# Altium project food_box_board.PrjPcb (part 1 of 2)
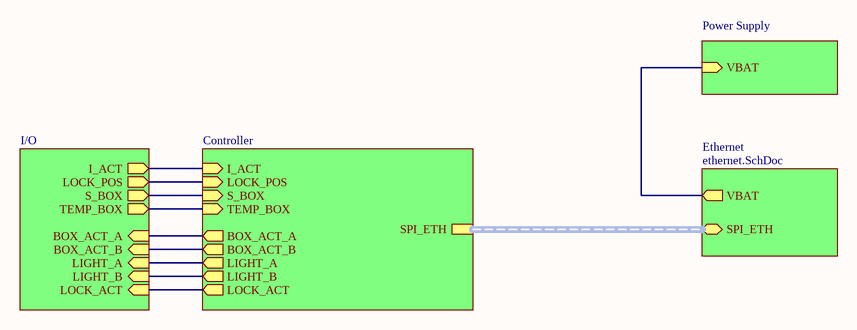
[diagram p0: food_box.SchDoc]
6 sheets, 76 parts. Net scope: hierarchical (ports join the sheet entries above them; power ports are global).
Board file: food_box_board.PcbDoc
Sheets:
  food_box.SchDoc
    Power Supply = power.SchDoc
    I/O = io.schdoc
      Light A = actuator.SchDoc
      Light B = actuator.SchDoc
      Box Actuator A = actuator.SchDoc
      Box Actuator B = actuator.SchDoc
    Controller = controller.SchDoc
    Ethernet = ethernet.SchDoc

## Sheet food_box.SchDoc
size Letter

### Sub-sheets
Controller = controller.SchDoc: LOCK_POS (in), S_BOX (in), TEMP_BOX (in), BOX_ACT_A (out), BOX_ACT_B (out), LIGHT_B (out), LIGHT_A (out), LOCK_ACT (out), I_ACT (in), SPI_ETH (harness SPI_ETH)
Ethernet = ethernet.SchDoc: SPI_ETH (bidir, harness SPI_ETH), VBAT (out)
I/O = io.schdoc: LOCK_POS (out), S_BOX (out), TEMP_BOX (out), BOX_ACT_A (in), LIGHT_B (in), LIGHT_A (in), BOX_ACT_B (in), LOCK_ACT (in), I_ACT (out)
Power Supply = power.SchDoc: VBAT (in)

### Nets
NetF1_1: sheet Power Supply/VBAT, sheet Ethernet/VBAT
NetH2_2: sheet I/O/LOCK_POS, sheet Controller/LOCK_POS
NetH5_1: sheet I/O/S_BOX, sheet Controller/S_BOX
NetR4_2: sheet I/O/LOCK_ACT, sheet Controller/LOCK_ACT
NetR11_Box_Actuator_A_2: sheet I/O/BOX_ACT_A, sheet Controller/BOX_ACT_A
NetR11_Box_Actuator_B_2: sheet I/O/BOX_ACT_B, sheet Controller/BOX_ACT_B
NetR11_Light_A_2: sheet I/O/LIGHT_A, sheet Controller/LIGHT_A
NetR11_Light_B_2: sheet I/O/LIGHT_B, sheet Controller/LIGHT_B
NetU_CN4_6: sheet I/O/TEMP_BOX, sheet Controller/TEMP_BOX
NetU_CN4_10: sheet I/O/I_ACT, sheet Controller/I_ACT

### Buses and harness runs
harness sheet Controller/SPI_ETH = sheet Ethernet/SPI_ETH

### Notes on the sheet
- Title
- Size:
- Date:
- Letter
- Number:
- Time:
- Revision:
- Sheet
- of
- File:

## Sheet power.SchDoc: Food Box Power Conditioning
size Letter
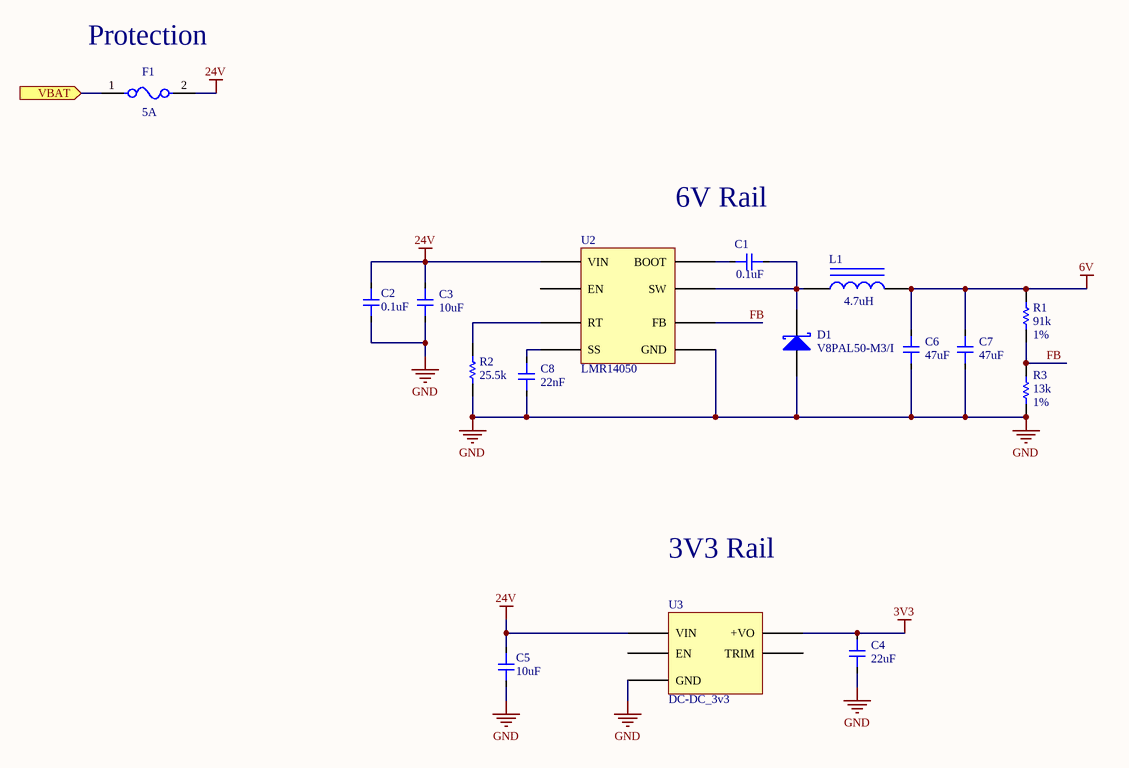
[diagram p1: power.SchDoc]

### Parts
C1  Capacitance: 0.1uF  [CAP 0805 L]  (hidden comment: value)
C2  Capacitance: 0.1uF  [CAP 0805 L]  (hidden comment: value)
C3  Capacitance: 10uF  [1210]  (hidden comment: value)
C4  Capacitance: 22uF  [CAP 0805 L]  (hidden comment: value)
C5  Capacitance: 10uF  [1206_CAP]  (hidden comment: value)
C6  Capacitance: 47uF  [1210]  (hidden comment: value)
C7  Capacitance: 47uF  [1210]  (hidden comment: value)
C8  value 22nF  [CAP 0805 L]  (hidden comment: value)
D1  Manufacturer Part Number: V8PAL50-M3/I  [DO-221BC]  (hidden comment: D Schottky)
F1  Current Rating: 5A  [Littelfuse_0154_0]  (hidden comment: 0154005.DRT)
L1  Inductance: 4.7uH  [SRP7050TA]  (hidden comment: Inductor Iron)
R1  Resistance: 91k  Tolerance: 1%  [RES 0603 L]  (hidden comment: Res1)
R2  Resistance: 25.5k  [RES 0603 L]  (hidden comment: Res1)
R3  Resistance: 13k  Tolerance: 1%  [RES 0603 L]  (hidden comment: Res1)
U2  LMR14050  [HSOIC-8]
U3  DC-DC_3v3  [V78E-1000-SMT]

### Ports
VBAT (in)

### Nets
3V3: C4.2 U3.4(+VO)
6V: C6.2 C7.2 L1.2 R1.2
24V: C2.2 C3.2 C5.2 F1.2 U2.2(VIN) U3.3(VIN)
GND: C2.1 C3.1 C4.1 C5.1 C6.1 C7.1 C8.1 D1.1(A) R2.1 R3.1 U2.7(GND) U3.2(GND)
FB: R1.1 R3.2 U2.5(FB)
NetC1_1: C1.1 U2.1(BOOT)
NetC1_2: C1.2 D1.2(K) L1.1 U2.8(SW)
NetC8_2: C8.2 U2.6(SS)
NetF1_1: F1.1 ; port VBAT
NetR2_2: R2.2 U2.4(RT)

Not connected (* = marked no-connect by the designer): U2 3(EN); U3 1(EN) 5(TRIM)

### Notes on the sheet
- (near F1) Protection
- 6V Rail
- 3V3 Rail
- Title
- Size:
- Date:
- Letter
- Number:
- Time:
- Revision:
- Sheet
- of
- File:

### Library data of the parts
C1 C2 = CAP 0805: CAP CER 0.1UF 50V X7R 0805; Manufacturer: Samsung; Manufacturer Part Number: CL21B104KBC5PNL; Tolerance: 10%; Supplier 1: Digi-Key; Supplier Part Number 1: 1276-7000-1-ND; Category: Ceramic Capacitors; Pricing 1: 1=0.10000, 10=0.06800, 50=0.03720, 100=0.03040, 500=0.02168, 1000=0.01704, 2500=0.01549, 5000=0.01425 (USD); Mount: Surface Mount; Case/Package: 0805; Min Operating Temperature: -55°C; Max Operating Temperature: 125°C; Voltage: 50V; Packaging: Tape and Reel; Dielectric: X7R; Length: 2mm; Height: 0.85mm; Depth: 1.25mm; Radiation Hardening: No; ComponentLink1URL: https://datasheet.ciiva.com/15195/getdatasheetpartid-359581-15195873.pdf?src-supplier=Verical; ComponentLink1Description: https://datasheet.ciiva.com/15195/getdatasheetpartid-359581-15195873.pdf?src-supplier=Verical
C3 = CAP 0805: TDK - C3225X7R1H106M250AC - C3225X7R1H106MT000E; Dielectric Material: Ceramic; Tolerance: 20%; Voltage Rating: 50V; Dielectric: X7R; Supplier 1: Digi-Key; Supplier Part Number 1: 445-14933-1-ND; Manufacturer: TDK; Manufacturer Part Number: C3225X7R1H106M250AC; Category: Ceramic Capacitors; Pricing 1: 1=1.03000, 10=0.78700, 50=0.65340, 100=0.56270, 500=0.43560 (USD); Mount: Surface Mount; Case/Package: 1210; Weight: 0.000564oz; Case Code (Metric): 3225; Case Code (Imperial): 1210; Min Operating Temperature: -55°C; Max Operating Temperature: 125°C; Package Quantity: 1000; Packaging: Tape and Reel; Termination: SMD/SMT; Voltage Rating (DC): 50V; Length: 0.126inch; Height: 2.5mm; Thickness: 0.11inch; Width: 0.098inch; REACH SVHC: No SVHC; Lead Free: Lead Free; ComponentLink1URL: http://www.farnell.com/datasheets/2792994.pdf?src-supplier=Farnell; ComponentLink1Description: http://www.farnell.com/datasheets/2792994.pdf?src-supplier=Farnell; ComponentLink2URL: http://www.mouser.com/ds/2/400/tdk_mlcc_commercial_general_en-542463.pdf?src-supplier=Mouser; ComponentLink2Description: http://www.mouser.com/ds/2/400/tdk_mlcc_commercial_general_en-542463.pdf?src-supplier=Mouser; ComponentLink3URL: https://product.tdk.com/info/en/documents/chara_sheet/C3225X7R1H106M250AC.pdf?src-supplier=Digi-Key; ComponentLink3Description: https://product.tdk.com/info/en/documents/chara_sheet/C3225X7R1H106M250AC.pdf?src-supplier=Digi-Key; ComponentLink4URL: http://product.tdk.com/capacitor/mlcc/en/documents/mlcc_commercial_general_en.pdf?src-supplier=Avnet; ComponentLink4Description: http://product.tdk.com/capacitor/mlcc/en/documents/mlcc_commercial_general_en.pdf?src-supplier=Avnet; ComponentLink5URL: http://www.farnell.com/datasheets/1913358.pdf?src-supplier=Element14; ComponentLink5Description: http://www.farnell.com/datasheets/1913358.pdf?src-supplier=Element14; ComponentLink6URL: http://www.farnell.com/datasheets/2291921.pdf?src-supplier=Newark; ComponentLink6Description: http://www.farnell.com/datasheets/2291921.pdf?src-supplier=Newark
C4 = CAP 0805: CAP CER 22UF 10V X6S 0805; Manufacturer: Murata; Manufacturer Part Number: GRT21BC81A226ME13L; Tolerance: 20%; Supplier 1: Digi-Key; Supplier Part Number 1: 490-12342-1-ND; Category: Ceramic Capacitors; Pricing 1: 1=0.61000, 10=0.42900, 50=0.32460, 100=0.28260, 500=0.20938, 1000=0.17796 (USD); Mount: Surface Mount; Case/Package: 0805; Case Code (Metric): 2012; Case Code (Imperial): 0805; Min Operating Temperature: -55°C; Max Operating Temperature: 105°C; Packaging: Tape and Reel; Voltage Rating: 10V; Length: 0.079inch; Width: 0.049inch; Thickness: 0.057inch; Ratings: AEC-Q200; Lead Free: Lead Free; ComponentLink1URL: http://search.murata.co.jp/Ceramy/image/img/A01X/G101/ENG/GRT21BC81A226ME13-01.pdf?src-supplier=Digi-Key; ComponentLink1Description: http://search.murata.co.jp/Ceramy/image/img/A01X/G101/ENG/GRT21BC81A226ME13-01.pdf?src-supplier=Digi-Key
C5 = CAP 0805: MURATA - GRT31CR61H106KE01L - SMD Multilayer Ceramic Capacitor, 10 µF, 50 V, 1206 [3216 Metric], ± 10%, X5R, GRT Series; Voltage Rating: 50V; Supplier 1: Digi-Key; Supplier Part Number 1: 490-12456-1-ND; Manufacturer: Murata; Manufacturer Part Number: GRT31CR61H106KE01L; Category: Ceramic Capacitors; Pricing 1: 1=0.73000, 10=0.51400, 50=0.38840, 100=0.33840, 500=0.25064, 1000=0.21304 (USD); Mount: Surface Mount; Case/Package: 1206; Case Code (Metric): 3216; Case Code (Imperial): 1206; Min Operating Temperature: -55°C; Max Operating Temperature: 85°C; Packaging: Cut Tape; Tolerance: 10%; Dielectric: X5R; Voltage Rating (DC): 50V; Length: 0.126inch; Width: 0.063inch; Thickness: 0.071inch; Ratings: AEC-Q200; ComponentLink1URL: http://www.farnell.com/datasheets/2166010.pdf?src-supplier=Farnell; ComponentLink1Description: http://www.farnell.com/datasheets/2166010.pdf?src-supplier=Farnell; ComponentLink2URL: http://search.murata.co.jp/Ceramy/image/img/A01X/G101/ENG/GRT31CR61H106KE01-01.pdf?src-supplier=Digi-Key; ComponentLink2Description: http://search.murata.co.jp/Ceramy/image/img/A01X/G101/ENG/GRT31CR61H106KE01-01.pdf?src-supplier=Digi-Key; ComponentLink3URL: http://www.farnell.com/datasheets/2166010.pdf?src-supplier=Newark; ComponentLink3Description: http://www.farnell.com/datasheets/2166010.pdf?src-supplier=Newark; ComponentLink4URL: http://www.farnell.com/datasheets/2166010.pdf?src-supplier=Element14; ComponentLink4Description: http://www.farnell.com/datasheets/2166010.pdf?src-supplier=Element14
C6 C7 = CAP 0805: KEMET - C1210C476M4PACTU. - CAPACITOR CERAMIC 47UF, 16V, X5R, 1210; Tolerance: 20%; Dissipation Factor: 10%; Supplier 1: Digi-Key; Supplier Part Number 1: 399-5514-1-ND; Manufacturer: KEMET; Manufacturer Part Number: C1210C476M4PACTU; Category: Ceramic Capacitors; Pricing 1: 1=1.16000, 10=0.88500, 50=0.73500, 100=0.63300, 500=0.49006 (USD); Mount: Surface Mount,PCB; Case/Package: 1210; Number of Pins: 2; Case Code (Metric): 3225; Case Code (Imperial): 1210; Dielectric Material: Ceramic; Contact Plating: Tin,Matte; Min Operating Temperature: -55°C; Max Operating Temperature: 85°C; Package Quantity: 1; Voltage Rating: 16V; Packaging: Tape and Reel; Voltage Rating (DC): 16V; Dielectric: X5R; Termination: SMD/SMT; Voltage: 16V; Length: 3.2mm; Height: 2.5mm; Width: 0.098inch; Depth: 2.5mm; Thickness: 0.11inch; Radiation Hardening: No; Lead Free: Lead Free; REACH SVHC: No SVHC; ComponentLink1URL: https://datasheet.ciiva.com/22705/652158-22705488.pdf?src-supplier=Element14; ComponentLink1Description: https://datasheet.ciiva.com/22705/652158-22705488.pdf?src-supplier=Element14; ComponentLink2URL: https://datasheet.ciiva.com/28608/1918694-28608774.pdf?src-supplier=Element14; ComponentLink2Description: https://datasheet.ciiva.com/28608/1918694-28608774.pdf?src-supplier=Element14
C8 = CAP 0805: Manufacturer: Yageo; Manufacturer Part Number: AC0805KRX7R8BB223; Voltage: 25V; Supplier 1: Digi-Key; Supplier Part Number 1: 311-3170-1-ND; Stock 1: 1274; Pricing 1: 1=0.24000, 10=0.16300, 100=0.08260, 500=0.05654, 1000=0.05001 (USD); RoHS: No
D1 = D Schottky: Schottky Diode; Manufacturer: Vishay Semiconductors; Forward Voltage: 570mV; Max Reverse Voltage (DC): 50V; Element Configuration: Single; Average Rectified Current: 4A; Forward Current: 8A; Max Forward Surge Current (Ifsm): 120A; Peak Reverse Current: 40mA; PackageDescription: DO-214-AA/SMB; 2 C-Bend Leads; Body 5.3 x 3.6 mm, inc. leads (LxW); Code_JEDEC: DO-214-AA; Supplier 1: Digi-Key; Supplier Part Number 1: V8PAL50-M3/ICT-ND; Stock 1: 9149; Pricing 1: 1=0.87000, 10=0.76600, 25=0.72000, 100=0.52250, 250=0.50388, 500=0.43654, 1000=0.37152, 2500=0.34830, 5000=0.31347 (USD); RoHS: Yes; Mount: Surface Mount; Number of Pins: 2; Weight: 0.001129oz; Min Operating Temperature: -40°C; Max Operating Temperature: 150°C; Packaging: Tape and Reel; Package Quantity: 14000; Max Repetitive Reverse Voltage (Vrrm): 50V; Peak Non-Repetitive Surge Current: 120A; Length: 4.35mm; Height: 1mm; Width: 2.7mm; REACH SVHC: Unknown; ComponentLink1URL: https://datasheet.ciiva.com/29591/v8pal50-29591381.pdf?src-supplier=Digi-Key; ComponentLink1Description: https://datasheet.ciiva.com/29591/v8pal50-29591381.pdf?src-supplier=Digi-Key; ComponentLink2URL: https://datasheet.ciiva.com/29591/v8pal50-29591382.pdf?src-supplier=Digi-Key; ComponentLink2Description: https://datasheet.ciiva.com/29591/v8pal50-29591382.pdf?src-supplier=Digi-Key; ComponentLink3URL: https://datasheet.ciiva.com/29591/v8pal50-29591383.pdf?src-supplier=Digi-Key; ComponentLink3Description: https://datasheet.ciiva.com/29591/v8pal50-29591383.pdf?src-supplier=Digi-Key
F1 = 0154005.DRT: FUSE BRD MNT 5A 125VAC/VDC 2SMD; Manufacturer: Littelfuse; Manufacturer Part Number: 0154005DRT; Color: White; Body Material: Ceramic,Thermoplastic; Voltage Rating (AC): 125V; DC Cold Resistance: 13.6mR; Power Dissipation: 125W; Fuse Type: Board Mount (Cartridge Style Excluded); Approvals: UL,PSE; Supplier 1: Digi-Key; Supplier Part Number 1: F1310CT-ND; Category: Fuses; Pricing 1: 1=3.140000, 5=3.040000, 10=2.935000, 50=2.306200, 100=1.886900, 250=1.834520, 500=1.572460 (USD); Mount: Surface Mount,Holder; Case/Package: SMD/SMT; Number of Pins: 2; Terminal Material: Copper; Min Operating Temperature: -55°C; Max Operating Temperature: 125°C; Packaging: Tape and Reel; Voltage Rating (DC): 125V; Package Quantity: 1500; Working Voltage: 125V; Voltage Rating: 125V; Termination: SMD/SMT; Fuse Current: 5A; Length: 9.73mm; Height: 3.81mm; Width: 5.03mm; Depth: 5.03mm; Radiation Hardening: No; Lead Free: Lead Free; REACH SVHC: Unknown; Flammability Rating: UL94 V-0; ComponentLink1URL: https://datasheet.ciiva.com/15187/getdatasheetpartid-71302-15187877.pdf?src-supplier=Verical; ComponentLink1Description: https://datasheet.ciiva.com/15187/getdatasheetpartid-71302-15187877.pdf?src-supplier=Verical; ComponentLink2URL: https://datasheet.ciiva.com/14159/aa154xxx-data-e-14159686.pdf?src-supplier=Distrelec; ComponentLink2Description: https://datasheet.ciiva.com/14159/aa154xxx-data-e-14159686.pdf?src-supplier=Distrelec; ComponentLink3URL: https://datasheet.ciiva.com/22712/1840330-22712966.pdf?src-supplier=Element14; ComponentLink3Description: https://datasheet.ciiva.com/22712/1840330-22712966.pdf?src-supplier=Element14; ComponentLink4URL: https://datasheet.ciiva.com/1268/1840330-1268664.pdf?src-supplier=Element14; ComponentLink4Description: https://datasheet.ciiva.com/1268/1840330-1268664.pdf?src-supplier=Element14; ComponentLink5URL: https://datasheet.ciiva.com/4483/littelfuse-fuse-154-154t-154l-154tl-datasheet-pdf-309941-4483517.pdf?src-supplier=Mouser; ComponentLink5Description: https://datasheet.ciiva.com/4483/littelfuse-fuse-154-154t-154l-154tl-datasheet-pdf-309941-4483517.pdf?src-supplier=Mouser; ComponentLink6URL: https://datasheet.ciiva.com/46406/1840330-46406109.pdf?src-supplier=Element14; ComponentLink6Description: https://datasheet.ciiva.com/46406/1840330-46406109.pdf?src-supplier=Element14; ComponentLink7URL: https://datasheet.ciiva.com/46406/1788337-46406175.pdf?src-supplier=Element14; ComponentLink7Description: https://datasheet.ciiva.com/46406/1788337-46406175.pdf?src-supplier=Element14
L1 = Inductor Iron: FIXED IND 4.7UH 6.5A 30.8 MOHM; Manufacturer: Bourns; Manufacturer Part Number: SRP7050TA-4R7M; Core Material: Carbonyl Powder; Saturation Current: 10A; Shielding: Shielded; DC Resistance (DCR): 30.8mR; Self Resonant Frequency: 22MHz; Test Frequency: 100kHz; Tolerance: 20%; Supplier 1: Digi-Key; Supplier Part Number 1: SRP7050TA-4R7MCT-ND; Category: Fixed Inductors; Pricing 1: 1=1.42000, 10=1.32300, 25=1.22120, 50=1.01760, 100=0.95650, 250=0.85472 (USD); Mount: Surface Mount; Case/Package: Nonstandard; Min Operating Temperature: -40°C; Max Operating Temperature: 150°C; Packaging: Cut Tape; Composition: Wirewound; Current Rating: 6.5A; RMS Current (Irms): 6.5A; Inductance Tolerance: 20%; Length: 0.287inch; Width: 0.26inch; Height - Seated (Max): 0.197inch; Ratings: AEC-Q200; REACH SVHC: No SVHC; ComponentLink1URL: http://www.bourns.com/docs/Product-Datasheets/SRP7050TA.pdf?src-supplier=Digi-Key; ComponentLink1Description: http://www.bourns.com/docs/Product-Datasheets/SRP7050TA.pdf?src-supplier=Digi-Key; ComponentLink2URL: http://www.farnell.com/datasheets/1955472.pdf?src-supplier=Element14; ComponentLink2Description: http://www.farnell.com/datasheets/1955472.pdf?src-supplier=Element14; ComponentLink3URL: https://www.bourns.com/docs/Product-Datasheets/SRP7050TA.pdf?src-supplier=Digi-Key; ComponentLink3Description: https://www.bourns.com/docs/Product-Datasheets/SRP7050TA.pdf?src-supplier=Digi-Key
R1 = Res1: Res Thick Film 0603 91K Ohm 1% 1/10W ±100ppm/°C Molded SMD SMD Paper T/R; Manufacturer: Vishay; Manufacturer Part Number: CRCW060391K0FKEA; Power Rating: 100mW; Voltage Rating: 75V; Supplier 1: Digi-Key; Supplier Part Number 1: 541-91.0KHCT-ND; Category: Chip SMD Resistors; Pricing 1: 1=0.10000, 10=0.03400, 100=0.01390, 1000=0.00623, 2500=0.00540 (USD); Mount: Surface Mount; Case/Package: 0603; Number of Pins: 2; Weight: 7.1E-05oz; Contact Plating: Tin; Case Code (Metric): 1608; Case Code (Imperial): 0603; Min Operating Temperature: -55°C; Max Operating Temperature: 155°C; Composition: Thick Film; Temperature Coefficient: 100ppm/°C; Packaging: Tape and Reel; Package Quantity: 10; Number of Terminations: 2; Termination: SMD/SMT; Max Power Dissipation: 100mW; Features: Automotive AEC-Q200; Military Standard: Not; Voltage Rating (DC): 75V; Length: 1.55mm; Height: 0.45mm; Width: 0.033inch; Depth: 0.85mm; Radiation Hardening: No; Lead Free: Lead Free; REACH SVHC: Unknown; ComponentLink1URL: https://datasheet.ciiva.com/11810/0900766b80d98afc-11810338.pdf?src-supplier=RSComponents; ComponentLink1Description: https://datasheet.ciiva.com/11810/0900766b80d98afc-11810338.pdf?src-supplier=RSComponents; ComponentLink2URL: https://datasheet.ciiva.com/2513/dcrcwe3-2513648.pdf?src-supplier=Digi-Key; ComponentLink2Description: https://datasheet.ciiva.com/2513/dcrcwe3-2513648.pdf?src-supplier=Digi-Key; ComponentLink3URL: https://datasheet.ciiva.com/2513/dcrcwe3-2513649.pdf?src-supplier=Digi-Key; ComponentLink3Description: https://datasheet.ciiva.com/2513/dcrcwe3-2513649.pdf?src-supplier=Digi-Key; ComponentLink4URL: https://datasheet.ciiva.com/7816/1697337-7816085.pdf?src-supplier=Element14; ComponentLink4Description: https://datasheet.ciiva.com/7816/1697337-7816085.pdf?src-supplier=Element14; ComponentLink5URL: https://datasheet.ciiva.com/16397/dcrcwe3-16397320.pdf?src-supplier=Future+Electronics; ComponentLink5Description: https://datasheet.ciiva.com/16397/dcrcwe3-16397320.pdf?src-supplier=Future+Electronics; ComponentLink6URL: https://datasheet.ciiva.com/16771/70201119-16771080.pdf?src-supplier=Allied+Electronics; ComponentLink6Description: https://datasheet.ciiva.com/16771/70201119-16771080.pdf?src-supplier=Allied+Electronics; ComponentLink7URL: https://datasheet.ciiva.com/26317/fld-crcw-e3-data-en-26317164.pdf?src-supplier=Distrelec; ComponentLink7Description: https://datasheet.ciiva.com/26317/fld-crcw-e3-data-en-26317164.pdf?src-supplier=Distrelec; ComponentLink8URL: https://datasheet.ciiva.com/8984/dcrcwe3-8984413.pdf?src-supplier=Avnet; ComponentLink8Description: https://datasheet.ciiva.com/8984/dcrcwe3-8984413.pdf?src-supplier=Avnet; ComponentLink9URL: https://datasheet.ciiva.com/5547/dcrcwe3-109170-5547038.pdf?src-supplier=Mouser; ComponentLink9Description: https://datasheet.ciiva.com/5547/dcrcwe3-109170-5547038.pdf?src-supplier=Mouser; ComponentLink10URL: https://datasheet.ciiva.com/2513/dcrcwe3-2513647.pdf?src-supplier=Digi-Key; ComponentLink10Description: https://datasheet.ciiva.com/2513/dcrcwe3-2513647.pdf?src-supplier=Digi-Key
R2 = Res1: RES SMD 25.5K OHM 1% 1/10W 0603; Manufacturer: Vishay; Manufacturer Part Number: CRCW060325K5FKEA; Temperature Coefficient: 100ppm/°C; Power Rating: 100mW; Voltage Rating: 75V; Supplier 1: Digi-Key; Supplier Part Number 1: 541-25.5KHCT-ND; Category: Chip SMD Resistors; Pricing 1: 1=0.10000, 10=0.03400, 100=0.01390, 1000=0.00623, 2500=0.00540 (USD); Case/Package: 0603; Number of Pins: 2; Weight: 7.1E-05oz; Contact Plating: Tin; Case Code (Metric): 1608; Case Code (Imperial): 0603; Min Operating Temperature: -55°C; Max Operating Temperature: 155°C; Tolerance: 1%; Packaging: Tape and Reel; Composition: Thick Film; Package Quantity: 10; Number of Terminations: 2; Termination: SMD/SMT; Max Power Dissipation: 100mW; Features: Automotive AEC-Q200; Military Standard: Not; Voltage Rating (DC): 75V; Working Voltage: 75V; Length: 1.55mm; Height: 0.45mm; Width: 0.033inch; Depth: 0.85mm; Radiation Hardening: No; Lead Free: Lead Free; REACH SVHC: Unknown; ComponentLink1URL: https://datasheet.ciiva.com/11810/0900766b80d98afc-11810483.pdf?src-supplier=RSComponents; ComponentLink1Description: https://datasheet.ciiva.com/11810/0900766b80d98afc-11810483.pdf?src-supplier=RSComponents; ComponentLink2URL: https://datasheet.ciiva.com/2465/dcrcwe3-2465664.pdf?src-supplier=Digi-Key; ComponentLink2Description: https://datasheet.ciiva.com/2465/dcrcwe3-2465664.pdf?src-supplier=Digi-Key; ComponentLink3URL: https://datasheet.ciiva.com/2465/dcrcwe3-2465665.pdf?src-supplier=Digi-Key; ComponentLink3Description: https://datasheet.ciiva.com/2465/dcrcwe3-2465665.pdf?src-supplier=Digi-Key; ComponentLink4URL: https://datasheet.ciiva.com/3257/dcrcwe3-3257318.pdf?src-supplier=Avnet; ComponentLink4Description: https://datasheet.ciiva.com/3257/dcrcwe3-3257318.pdf?src-supplier=Avnet; ComponentLink5URL: https://datasheet.ciiva.com/3257/dcrcwe3-3257319.pdf?src-supplier=Avnet; ComponentLink5Description: https://datasheet.ciiva.com/3257/dcrcwe3-3257319.pdf?src-supplier=Avnet; ComponentLink6URL: https://datasheet.ciiva.com/16202/dcrcwe3-16202503.pdf?src-supplier=Future+Electronics; ComponentLink6Description: https://datasheet.ciiva.com/16202/dcrcwe3-16202503.pdf?src-supplier=Future+Electronics; ComponentLink7URL: https://datasheet.ciiva.com/7173/1635184-7173016.pdf?src-supplier=Newark; ComponentLink7Description: https://datasheet.ciiva.com/7173/1635184-7173016.pdf?src-supplier=Newark; ComponentLink8URL: https://datasheet.ciiva.com/16882/dcrcwe3-16882729.pdf?src-supplier=Avnet+Europe; ComponentLink8Description: https://datasheet.ciiva.com/16882/dcrcwe3-16882729.pdf?src-supplier=Avnet+Europe; ComponentLink9URL: https://datasheet.ciiva.com/22675/1847332-22675962.pdf?src-supplier=Element14; ComponentLink9Description: https://datasheet.ciiva.com/22675/1847332-22675962.pdf?src-supplier=Element14; ComponentLink10URL: https://datasheet.ciiva.com/22702/1697337-22702891.pdf?src-supplier=Element14; ComponentLink10Description: https://datasheet.ciiva.com/22702/1697337-22702891.pdf?src-supplier=Element14; ComponentLink11URL: https://datasheet.ciiva.com/22869/70201119-22869452.pdf?src-supplier=Allied+Electronics; ComponentLink11Description: https://datasheet.ciiva.com/22869/70201119-22869452.pdf?src-supplier=Allied+Electronics; ComponentLink12URL: https://datasheet.ciiva.com/2465/dcrcwe3-2465663.pdf?src-supplier=Digi-Key; ComponentLink12Description: https://datasheet.ciiva.com/2465/dcrcwe3-2465663.pdf?src-supplier=Digi-Key; ComponentLink13URL: https://datasheet.ciiva.com/5541/dcrcwe3-109170-5541965.pdf?src-supplier=Mouser; ComponentLink13Description: https://datasheet.ciiva.com/5541/dcrcwe3-109170-5541965.pdf?src-supplier=Mouser
R3 = Res1: Res Thick Film 0603 13K Ohm 1% 1/10W 100ppm/C Molded SMD SMD Paper T/R; Manufacturer: Vishay Dale; Manufacturer Part Number: CRCW060313K0FKTA; Power Rating: 100mW; Voltage Rating: 75V; Temperature Coefficient: 100ppm/°C; Supplier 1: Digi-Key; Supplier Part Number 1: 541-CRCW060313K0FKTACT-ND; Category: Chip SMD Resistors; Pricing 1: 1=0.13000, 10=0.12000, 100=0.04620, 1000=0.02033, 2500=0.01756 (USD); Case/Package: 0603; Number of Pins: 2; Weight: 7.1E-05oz; Case Code (Imperial): 0603; Case Code (Metric): 1608; Contact Plating: Tin,Lead; Min Operating Temperature: -55°C; Max Operating Temperature: 155°C; Packaging: Tape and Reel; Package Quantity: 5000; Composition: Thick Film; Number of Terminations: 2; Military Standard: Not; Max Power Dissipation: 100mW; Power Dissipation: 100mW; Voltage Rating (DC): 75V; Features: Automotive AEC-Q200; Length: 1.55mm; Height: 0.02inch; Width: 0.85mm; Depth: 0.85mm; Radiation Hardening: No; Lead Free: Contains Lead; REACH SVHC: Unknown; ComponentLink1URL: https://datasheet.ciiva.com/15159/getdatasheetpartid-33120-15159398.pdf?src-supplier=Verical; ComponentLink1Description: https://datasheet.ciiva.com/15159/getdatasheetpartid-33120-15159398.pdf?src-supplier=Verical; ComponentLink2URL: https://datasheet.ciiva.com/2564/dcrcw-2564949.pdf?src-supplier=Digi-Key; ComponentLink2Description: https://datasheet.ciiva.com/2564/dcrcw-2564949.pdf?src-supplier=Digi-Key; ComponentLink3URL: https://datasheet.ciiva.com/9043/dcrcw-9043261.pdf?src-supplier=Avnet; ComponentLink3Description: https://datasheet.ciiva.com/9043/dcrcw-9043261.pdf?src-supplier=Avnet

## Sheet io.schdoc
size Letter
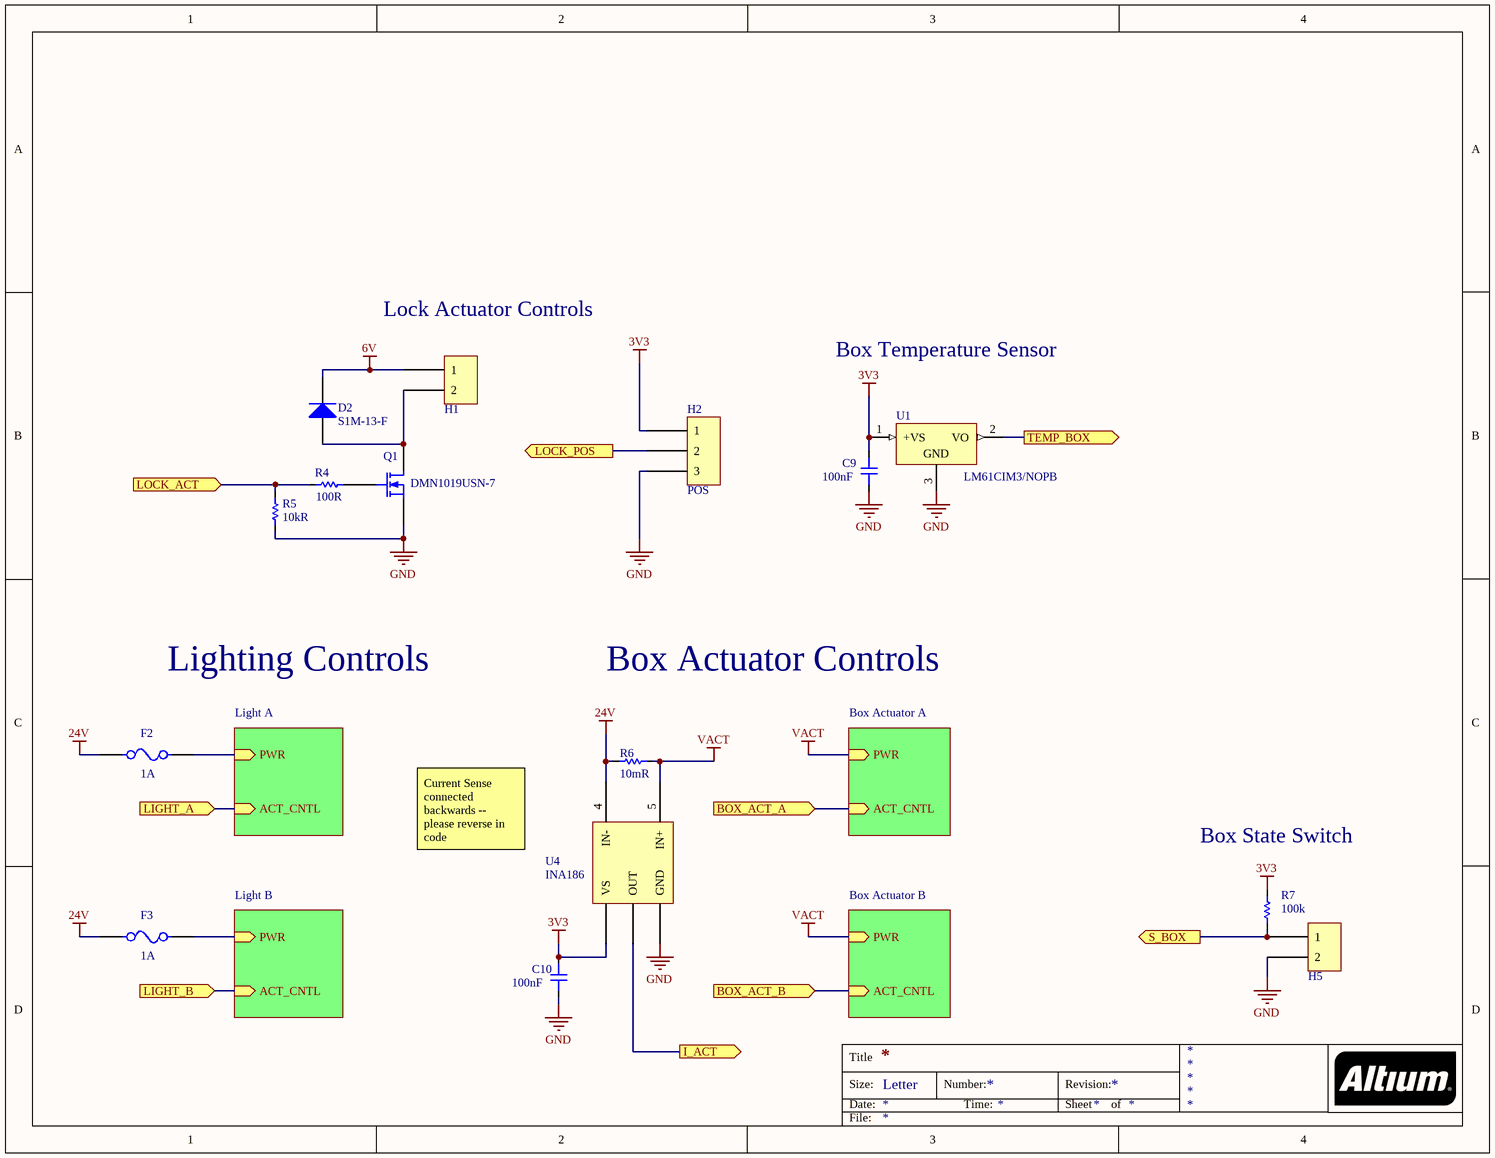
[diagram p2: io.schdoc]

### Parts
C9  Capacitance: 100nF  [CAP 0805 L]  (hidden comment: value)
C10  Capacitance: 100nF  [CAP 0805 L]  (hidden comment: value)
D2  S1M-13-F  [SMA]
F2  Current Rating: 1A  [Littelfuse_0154_0]  (hidden comment: 0154001.DRT)
F3  Current Rating: 1A  [Littelfuse_0154_0]  (hidden comment: 0154001.DRT)
H1  MOLEX_43650_2  [MOLEX_43650_2]  (value not drawn)
H2  POS  [MOLEX_43650_3]
H5  MOLEX_43650_2  [MOLEX_43650_2]  (value not drawn)
Q1  Manufacturer Part Number: DMN1019USN-7  [SOT23-3]  (hidden comment: MOSFET-N)
R4  Resistance: 100R  [RES 0603 L]  (hidden comment: value)
R5  Resistance: 10kR  [RES 0603 L]  (hidden comment: value)
R6  10mR  [CAP 0805 L]
R7  Resistance: 100k  [RES 0603 L]  (hidden comment: value)
U1  LM61CIM3/NOPB  [DBZ0003A_L]
U4  INA186  [SOT23-5]

### Sub-sheets
Box Actuator A = actuator.SchDoc: PWR (in), ACT_CNTL (in)
Box Actuator B = actuator.SchDoc: PWR (in), ACT_CNTL (in)
Light A = actuator.SchDoc: PWR (in), ACT_CNTL (in)
Light B = actuator.SchDoc: PWR (in), ACT_CNTL (in)

### Ports
BOX_ACT_A (in), BOX_ACT_B (in), I_ACT (out), LIGHT_A (in), LIGHT_B (in), LOCK_ACT (in), LOCK_POS (out), S_BOX (out), TEMP_BOX (out)

### Nets
3V3: C9.2 C10.2 H2.1 R7.2 U1.1(+VS) U4.3(VS)
6V: D2.2(K) H1.1
24V: F2.1 F3.1 R6.2 U4.4(IN-)
GND: C9.1 C10.1 H2.3 H5.2 Q1.3(S) R5.1 U1.3(GND) U4.1(GND)
VACT: R6.1 U4.5(IN+) ; sheet Box Actuator A/PWR, sheet Box Actuator B/PWR
NetD2_1: D2.1(A) H1.2 Q1.1(D)
NetD5_Light_A_2: F2.2 ; sheet Light A/PWR
NetD5_Light_B_2: F3.2 ; sheet Light B/PWR
NetH2_2: H2.2 ; port LOCK_POS
NetH5_1: H5.1 R7.1 ; port S_BOX
NetQ1_2: Q1.2(G) R4.1
NetR4_2: R4.2 R5.2 ; port LOCK_ACT
NetR11_Box_Actuator_A_2: port BOX_ACT_A, sheet Box Actuator A/ACT_CNTL
NetR11_Box_Actuator_B_2: port BOX_ACT_B, sheet Box Actuator B/ACT_CNTL
NetR11_Light_A_2: port LIGHT_A, sheet Light A/ACT_CNTL
NetR11_Light_B_2: port LIGHT_B, sheet Light B/ACT_CNTL
NetU_CN4_6: U1.2(VO) ; port TEMP_BOX
NetU_CN4_10: U4.2(OUT) ; port I_ACT

### Notes on the sheet
- (near H1) Lock Actuator Controls
- Box Temperature Sensor
- Lighting Controls
- Box Actuator Controls
- Current Sense connected backwards -- please reverse in code
- (near R7) Box State Switch
- Title
- Size:
- Date:
- Letter
- Number:
- Time:
- Revision:
- Sheet
- of
- File:

### Library data of the parts
C9 C10 = CAP 0805: SMD Multilayer Ceramic Capacitor, AEC-Q200 C Series, 0.1 F, 10%, X7R, 25 V, 0805 [2012 Metric] ;RoHS Compliant: Yes; Manufacturer: KEMET; Manufacturer Part Number: C0805C104K3RACAUTO; Voltage Rating: 25V; Supplier 1: Digi-Key; Supplier Part Number 1: 399-6927-1-ND; Category: Ceramic Capacitors; Pricing 1: 1=0.18000, 10=0.12000, 50=0.07220, 100=0.06100, 500=0.04174, 1000=0.03693 (USD); Mount: Surface Mount; Case/Package: 0805; Case Code (Metric): 2012; Case Code (Imperial): 0805; Dielectric Material: Ceramic; Min Operating Temperature: -55°C; Max Operating Temperature: 125°C; Tolerance: 10%; Dielectric: X7R; Packaging: Tape and Reel; Package Quantity: 1; Voltage Rating (DC): 25V; Length: 2mm; Height: 0.9mm; Depth: 1.25mm; Width: 0.049inch; Thickness: 0.035inch; Ratings: AEC-Q200; Radiation Hardening: No; REACH SVHC: No SVHC; ComponentLink1URL: http://components.arrow.com/part/dataview/43510470S8189391N7429?src-supplier=Arrow; ComponentLink1Description: http://components.arrow.com/part/dataview/43510470S8189391N7429?src-supplier=Arrow; ComponentLink2URL: http://components.arrow.com/part/dataview/0323_00324902?src-supplier=Arrow+Europe; ComponentLink2Description: http://components.arrow.com/part/dataview/0323_00324902?src-supplier=Arrow+Europe; ComponentLink3URL: http://www.farnell.com/datasheets/2314205.pdf?src-supplier=Farnell; ComponentLink3Description: http://www.farnell.com/datasheets/2314205.pdf?src-supplier=Farnell; ComponentLink4URL: http://www.farnell.com/datasheets/2120825.pdf?src-supplier=Farnell; ComponentLink4Description: http://www.farnell.com/datasheets/2120825.pdf?src-supplier=Farnell; ComponentLink5URL: https://www.verical.com/server-webapp/html/getDatasheet?partID=469266&src-supplier=Verical; ComponentLink5Description: https://www.verical.com/server-webapp/html/getDatasheet?partID=469266&src-supplier=Verical; ComponentLink6URL: http://capacitoredge.kemet.com/capedge2/DataSheet?pn=C0805C104K3RACAUTO&src-supplier=Avnet+Europe; ComponentLink6Description: http://capacitoredge.kemet.com/capedge2/DataSheet?pn=C0805C104K3RACAUTO&src-supplier=Avnet+Europe; ComponentLink7URL: http://www.farnell.com/datasheets/2120825.pdf?src-supplier=Element14; ComponentLink7Description: http://www.farnell.com/datasheets/2120825.pdf?src-supplier=Element14; ComponentLink8URL: https://search.kemet.com/component-edge/download/datasheet/C0805C104K3RACAUTO.pdf?src-supplier=Digi-Key; ComponentLink8Description: https://search.kemet.com/component-edge/download/datasheet/C0805C104K3RACAUTO.pdf?src-supplier=Digi-Key; ComponentLink9URL: https://api.kemet.com/component-edge/download/datasheet/C0805C104K3RACAUTO.pdf?src-supplier=Digi-Key; ComponentLink9Description: https://api.kemet.com/component-edge/download/datasheet/C0805C104K3RACAUTO.pdf?src-supplier=Digi-Key
D2 = Diode: Default Diode
F2 F3 = 0154005.DRT: LITTELFUSE - 0154001.DRT - FUSE, SMD, 1A, OMNI BLOCK, TIME DELAY; Color: White; Body Material: Thermoplastic; DC Cold Resistance: 225mR; Power Dissipation: 125W; Fuse Type: Board Mount (Cartridge Style Excluded); Voltage Rating (AC): 125V; Approvals: UL,PSE; Supplier 1: Digi-Key; Supplier Part Number 1: F1303TR-ND; Manufacturer: Littelfuse; Manufacturer Part Number: 0154001.DRT; Category: Fuses; Pricing 1: 1500=1.31037, 3000=1.23890, 7500=1.19125 (USD); Mount: Surface Mount,Holder; Case/Package: SMD/SMT; Number of Pins: 2; Terminal Material: Copper; Min Operating Temperature: -55°C; Max Operating Temperature: 125°C; Voltage Rating (DC): 125V; Packaging: Tape and Reel; Package Quantity: 1500; Fuse Current: 1A; Working Voltage: 125V; Voltage Rating: 125V; Length: 9.73mm; Height: 3.81mm; Depth: 5.03mm; Width: 5.03mm; Radiation Hardening: No; Lead Free: Lead Free; REACH SVHC: Unknown; Flammability Rating: UL94 V-0; ComponentLink1URL: https://datasheet.ciiva.com/1268/1840330-1268625.pdf?src-supplier=Element14; ComponentLink1Description: https://datasheet.ciiva.com/1268/1840330-1268625.pdf?src-supplier=Element14; ComponentLink2URL: https://datasheet.ciiva.com/4485/littelfuse-fuseblocks-154-155-4485399.pdf?src-supplier=Mouser; ComponentLink2Description: https://datasheet.ciiva.com/4485/littelfuse-fuseblocks-154-155-4485399.pdf?src-supplier=Mouser; ComponentLink3URL: https://datasheet.ciiva.com/14102/aa154xxx-data-e-14102970.pdf?src-supplier=Distrelec; ComponentLink3Description: https://datasheet.ciiva.com/14102/aa154xxx-data-e-14102970.pdf?src-supplier=Distrelec; ComponentLink4URL: https://datasheet.ciiva.com/46406/1840330-46406107.pdf?src-supplier=Element14; ComponentLink4Description: https://datasheet.ciiva.com/46406/1840330-46406107.pdf?src-supplier=Element14; ComponentLink5URL: https://datasheet.ciiva.com/46406/1788337-46406172.pdf?src-supplier=Element14; ComponentLink5Description: https://datasheet.ciiva.com/46406/1788337-46406172.pdf?src-supplier=Element14; ComponentLink6URL: https://datasheet.ciiva.com/22712/1840330-22712958.pdf?src-supplier=Element14; ComponentLink6Description: https://datasheet.ciiva.com/22712/1840330-22712958.pdf?src-supplier=Element14
H1 H5 = MOLEX_43650_2: MOLEX - 43650-0227 - Wire-To-Board Connector, 3 mm, 2 Contacts, Header, Micro-Fit 3.0 43650 Series, Through Hole, 1 Rows; Connector Type: Header,Male Pin; Number of Positions: 2; Number of Ports: 1; Pitch: 3mm; Supplier 1: Digi-Key; Supplier Part Number 1: WM10656-ND; Manufacturer: Molex; Manufacturer Part Number: 43650-0227; Category: Connectors; Pricing 1: 1=0.80000, 10=0.74800, 100=0.57340, 500=0.49860, 1000=0.41135, 5000=0.36149, 10000=0.33656 (USD); Mount: Through Hole; Contact Plating: Tin,Bright; Color: Black; Contact Material: Brass; Housing Material: Thermoplastic; Number of Terminals: 2; Contact Shape: Square; Insulation Material: Polymer; Min Operating Temperature: -40°C; Max Operating Temperature: 105°C; Packaging: Tray; Package Quantity: 3264; Number of Rows: 1; Termination: Solder; Fastening Type: Ramp; Number of Contacts: 2; Orientation: Straight; Length: 9.65mm; Depth: 5.57mm; ComponentLink1URL: https://datasheet.ciiva.com/6840/436500227-sd-6840390.pdf?src-supplier=Digi-Key; ComponentLink1Description: https://datasheet.ciiva.com/6840/436500227-sd-6840390.pdf?src-supplier=Digi-Key; ComponentLink2URL: https://datasheet.ciiva.com/3944/28290436500227-pcb-headers-3944690.pdf?src-supplier=Arrow; ComponentLink2Description: https://datasheet.ciiva.com/3944/28290436500227-pcb-headers-3944690.pdf?src-supplier=Arrow; ComponentLink3URL: https://datasheet.ciiva.com/30077/0436500227-pcb-headers-30077244.pdf?src-supplier=Onlinecomponents.com; ComponentLink3Description: https://datasheet.ciiva.com/30077/0436500227-pcb-headers-30077244.pdf?src-supplier=Onlinecomponents.com; ComponentLink4URL: https://datasheet.ciiva.com/7920/1629867-7920765.pdf?src-supplier=Element14; ComponentLink4Description: https://datasheet.ciiva.com/7920/1629867-7920765.pdf?src-supplier=Element14
H2 = TERM_3P: Stepper position potentiometer
Q1 = MOSFET-N: MOSFET 12V N-Ch Enh FET 2426pF 27.3nC; Manufacturer: Diodes; Continuous Drain Current (ID): 9.3A; Rds On Max: 10mR; Input Capacitance: 2.426nF; Max Power Dissipation: 680mW; Capacitance: 2.426E-09F; Element Configuration: Single; Number of Channels: 1; Drain to Source Resistance: 41mR; Gate to Source Voltage (Vgs): 4.5V; Fall Time: 16.8ns; Rise Time: 57.6ns; Turn-Off Delay Time: 22.2ns; Turn-On Delay Time: 7.6ns; Supplier 1: Digi-Key; Supplier Part Number 1: DMN1019USN-7DICT-ND; Category: MOSFETs; Pricing 1: 1=0.43000, 10=0.34700, 25=0.31800, 100=0.19960, 250=0.19740, 500=0.18482, 1000=0.12568 (USD); Mount: Surface Mount; Case/Package: TO-236-3; Weight: 0.000282oz; Min Operating Temperature: -55°C; Max Operating Temperature: 150°C; Packaging: Tape and Reel; Drain to Source Voltage (Vdss): 12V; Drain to Source Breakdown Voltage: 12V; Package Quantity: 3000; Lead Free: Lead Free; ComponentLink1URL: http://www.farnell.com/datasheets/2814395.pdf?src-supplier=Farnell; ComponentLink1Description: http://www.farnell.com/datasheets/2814395.pdf?src-supplier=Farnell; ComponentLink2URL: http://www.mouser.com/ds/2/115/DMN1019USN-336718.pdf?src-supplier=Mouser; ComponentLink2Description: http://www.mouser.com/ds/2/115/DMN1019USN-336718.pdf?src-supplier=Mouser; ComponentLink3URL: https://www.diodes.com/assets/Datasheets/DMN1019USN.pdf?src-supplier=Digi-Key; ComponentLink3Description: https://www.diodes.com/assets/Datasheets/DMN1019USN.pdf?src-supplier=Digi-Key; ComponentLink4URL: http://www.farnell.com/datasheets/2814395.pdf?src-supplier=Newark; ComponentLink4Description: http://www.farnell.com/datasheets/2814395.pdf?src-supplier=Newark
R4 = RES 0603: CRGCQ 0603 100R 5%; Manufacturer: TE Connectivity; Manufacturer Part Number: CRGCQ0603J100R; Max Power Dissipation: 100mW; Temperature Coefficient: 100ppm/°C; Supplier 1: Digi-Key; Supplier Part Number 1: A130085CT-ND; Category: Chip SMD Resistors; Pricing 1: 1=0.10000, 10=0.02100, 100=0.00860, 1000=0.00387, 2500=0.00336 (USD); Case/Package: 0603; Case Code (Imperial): 0603; Case Code (Metric): 1608; Min Operating Temperature: -55°C; Max Operating Temperature: 155°C; Composition: Thick Film; Features: Moisture Resistant,Automotive AEC-Q200; Packaging: Cut Tape; Tolerance: 5%; Number of Terminations: 2; ComponentLink1URL: https://www.te.com/commerce/DocumentDelivery/DDEController?Action=srchrtrv&amp;DocNm=1773204-3&amp;DocType=DS&amp;DocLang=English&src-supplier=Digi-Key; ComponentLink1Description: https://www.te.com/commerce/DocumentDelivery/DDEController?Action=srchrtrv&amp;DocNm=1773204-3&amp;DocType=DS&amp;DocLang=English&src-supplier=Digi-Key
R5 = RES 0603: TE CONNECTIVITY - CRGCQ0603J10K - RES, 10K, 5%, 0603, THICK FILM; Max Power Dissipation: 100mW; Temperature Coefficient: 100ppm/°C; Supplier 1: Digi-Key; Supplier Part Number 1: A130097CT-ND; Manufacturer: TE Connectivity; Manufacturer Part Number: CRGCQ0603J10K; Category: Chip SMD Resistors; Pricing 1: 1=0.10000, 10=0.02100, 100=0.00860, 1000=0.00387, 2500=0.00336 (USD); Case/Package: 0603; Case Code (Imperial): 0603; Case Code (Metric): 1608; Min Operating Temperature: -55°C; Max Operating Temperature: 155°C; Composition: Thick Film; Features: Moisture Resistant,Automotive AEC-Q200; Packaging: Tape and Reel; Tolerance: 5%; Number of Terminations: 2; ComponentLink1URL: https://4donline.ihs.com/images/VipMasterIC/IC/TYEL/TYEL-S-A0004929575/TYEL-S-A0004929575-1.pdf?hkey=52A5661711E402568146F3353EA87419&src-supplier=Farnell; ComponentLink1Description: https://4donline.ihs.com/images/VipMasterIC/IC/TYEL/TYEL-S-A0004929575/TYEL-S-A0004929575-1.pdf?hkey=52A5661711E402568146F3353EA87419&src-supplier=Farnell; ComponentLink2URL: https://4donline.ihs.com/images/VipMasterIC/IC/TYEL/TYEL-S-A0004929575/TYEL-S-A0004929575-1.pdf?hkey=52A5661711E402568146F3353EA87419&src-supplier=Newark; ComponentLink2Description: https://4donline.ihs.com/images/VipMasterIC/IC/TYEL/TYEL-S-A0004929575/TYEL-S-A0004929575-1.pdf?hkey=52A5661711E402568146F3353EA87419&src-supplier=Newark; ComponentLink3URL: https://www.te.com/commerce/DocumentDelivery/DDEController?Action=srchrtrv&amp;DocNm=1773204-3&amp;DocType=DS&amp;DocLang=English&src-supplier=Digi-Key; ComponentLink3Description: https://www.te.com/commerce/DocumentDelivery/DDEController?Action=srchrtrv&amp;DocNm=1773204-3&amp;DocType=DS&amp;DocLang=English&src-supplier=Digi-Key; ComponentLink4URL: http://www.te.com/commerce/DocumentDelivery/DDEController?Action=srchrtrv&DocNm=1773204-3&DocType=DS&DocLang=English&src-supplier=Digi-Key; ComponentLink4Description: http://www.te.com/commerce/DocumentDelivery/DDEController?Action=srchrtrv&DocNm=1773204-3&DocType=DS&DocLang=English&src-supplier=Digi-Key
R6 = RES 0603: Resistor Thick Film 0.01Ohm 0.5% 0.5W 2-Pin 0805 T/R; Manufacturer: Panasonic; Manufacturer Part Number: ERJ-6CWDR010V; Supplier 1: Digi-Key; Supplier Part Number 1: P124401CT-ND; Pricing 1: 1=0.65000, 10=0.48100, 25=0.39000, 50=0.33920, 100=0.27990, 250=0.24312, 500=0.19790, 1000=0.15696 (USD)
R7 = RES 0603: CRGCQ 0603 100K 5%; Manufacturer: TE Connectivity; Manufacturer Part Number: CRGCQ0603J100K; Max Power Dissipation: 100mW; Temperature Coefficient: 100ppm/°C; Supplier 1: Digi-Key; Supplier Part Number 1: A130103CT-ND; Category: Chip SMD Resistors; Pricing 1: 1=0.10000, 10=0.02100, 100=0.00860, 1000=0.00387, 2500=0.00336 (USD); Case/Package: 0603; Case Code (Imperial): 0603; Case Code (Metric): 1608; Min Operating Temperature: -55°C; Max Operating Temperature: 155°C; Composition: Thick Film; Features: Moisture Resistant,Automotive AEC-Q200; Packaging: Tape and Reel; Tolerance: 5%; Number of Terminations: 2; ComponentLink1URL: https://www.te.com/commerce/DocumentDelivery/DDEController?Action=srchrtrv&amp;DocNm=1773204-3&amp;DocType=DS&amp;DocLang=English&src-supplier=Digi-Key; ComponentLink1Description: https://www.te.com/commerce/DocumentDelivery/DDEController?Action=srchrtrv&amp;DocNm=1773204-3&amp;DocType=DS&amp;DocLang=English&src-supplier=Digi-Key; ComponentLink2URL: https://4donline.ihs.com/images/VipMasterIC/IC/TYEL/TYEL-S-A0004929575/TYEL-S-A0004929575-1.pdf?hkey=52A5661711E402568146F3353EA87419&src-supplier=Farnell; ComponentLink2Description: https://4donline.ihs.com/images/VipMasterIC/IC/TYEL/TYEL-S-A0004929575/TYEL-S-A0004929575-1.pdf?hkey=52A5661711E402568146F3353EA87419&src-supplier=Farnell; ComponentLink3URL: https://4donline.ihs.com/images/VipMasterIC/IC/TYEL/TYEL-S-A0004929575/TYEL-S-A0004929575-1.pdf?hkey=52A5661711E402568146F3353EA87419&src-supplier=Newark; ComponentLink3Description: https://4donline.ihs.com/images/VipMasterIC/IC/TYEL/TYEL-S-A0004929575/TYEL-S-A0004929575-1.pdf?hkey=52A5661711E402568146F3353EA87419&src-supplier=Newark; ComponentLink4URL: https://4donline.ihs.com/images/VipMasterIC/IC/TYEL/TYEL-S-A0004929575/TYEL-S-A0004929575-1.pdf?hkey=52A5661711E402568146F3353EA87419&src-supplier=Element14; ComponentLink4Description: https://4donline.ihs.com/images/VipMasterIC/IC/TYEL/TYEL-S-A0004929575/TYEL-S-A0004929575-1.pdf?hkey=52A5661711E402568146F3353EA87419&src-supplier=Element14
U1 = CMP-0066-00260-3: 2.7V Temperature Sensor, 3-pin SOT-23, Pb-Free; Manufacturer: Texas Instruments; PowerWise: N; PackageTopMarking: T1C*XTT; CompType: Temp Sensor IC; PackageReference: DBZ0003A; ComponentLink1URL: http://www.ti.com/general/docs/lit/getliterature.tsp?genericPartNumber=LM61&fileType=pdf; PinCount: 3; PackageDescription: Molded SOT-23, .115 x .051 x .037in Body, 3 Lead, .075 in Pitch; ComponentLink1Description: Datasheet URL; RoHS: Y

## Sheet actuator.SchDoc: Actuator Controls
size Letter
Used 4 times, as channels I/O/Light A, I/O/Light B, I/O/Box Actuator A, I/O/Box Actuator B. Parts and nets are listed once, with the designators drawn on the sheet.
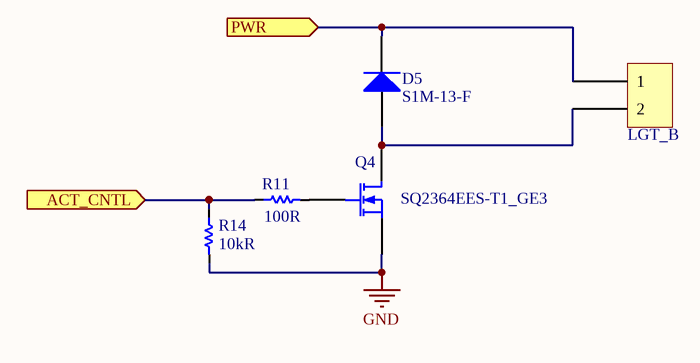
[diagram p3: actuator.SchDoc]

### Parts
D5  S1M-13-F  [SMA]
LGT_B  MOLEX_43650_2  [MOLEX_43650_2]  (value not drawn)
Q4  Manufacturer Part Number: SQ2364EES-T1_GE3  [SOT23-3]  (hidden comment: MOSFET-N)
R11  Resistance: 100R  [RES 0603 L]  (hidden comment: value)
R14  Resistance: 10kR  [RES 0603 L]  (hidden comment: value)

### Ports
ACT_CNTL (in), PWR (in)

### Nets
GND: Q4.3(S) R14.1
ACT_CNTL: R11.2 R14.2 ; port ACT_CNTL
PWR: D5.2(K) LGT_B.1 ; port PWR
NetD5_1: D5.1(A) LGT_B.2 Q4.1(D)
NetQ4_2: Q4.2(G) R11.1

### Channels
I/O/Light A: designators D5=D5_Light_A LGT_B=LGT_A Q4=Q4_Light_A R11=R11_Light_A R14=R14_Light_A; ports ACT_CNTL=NetR11_Light_A_2 PWR=NetD5_Light_A_2
I/O/Light B: designators D5=D5_Light_B LGT_B=LGT_B Q4=Q4_Light_B R11=R11_Light_B R14=R14_Light_B; ports ACT_CNTL=NetR11_Light_B_2 PWR=NetD5_Light_B_2
I/O/Box Actuator A: designators D5=D5_Box_Actuator_A LGT_B=ACT_A Q4=Q4_Box_Actuator_A R11=R11_Box_Actuator_A R14=R14_Box_Actuator_A; ports ACT_CNTL=NetR11_Box_Actuator_A_2 PWR=VACT
I/O/Box Actuator B: designators D5=D5_Box_Actuator_B LGT_B=ACT_B Q4=Q4_Box_Actuator_B R11=R11_Box_Actuator_B R14=R14_Box_Actuator_B; ports ACT_CNTL=NetR11_Box_Actuator_B_2 PWR=VACT

### Notes on the sheet
- Title
- Size:
- Date:
- Letter
- Number:
- Time:
- Revision:
- Sheet
- of
- File:

### Library data of the parts
D5 = Diode: Default Diode
LGT_B = MOLEX_43650_2: as H1 on sheet io; Supplier 1: Digi-Key; Supplier Part Number 1: WM10656-ND; Manufacturer: Molex; Manufacturer Part Number: 43650-0227; Category: Connectors; Pricing 1: 1=0.80000, 10=0.74800, 100=0.57340, 500=0.49860, 1000=0.41135, 5000=0.36149, 10000=0.33656 (USD); Mount: Through Hole; Contact Plating: Tin,Bright; Color: Black; Contact Material: Brass; Housing Material: Thermoplastic; Number of Terminals: 2; Contact Shape: Square; Insulation Material: Polymer; Min Operating Temperature: -40°C; Max Operating Temperature: 105°C; Packaging: Tray; Package Quantity: 3264; Number of Rows: 1; Termination: Solder; Fastening Type: Ramp; Number of Contacts: 2; Orientation: Straight; Length: 9.65mm; Depth: 5.57mm; ComponentLink1URL: https://datasheet.ciiva.com/6840/436500227-sd-6840390.pdf?src-supplier=Digi-Key; ComponentLink1Description: https://datasheet.ciiva.com/6840/436500227-sd-6840390.pdf?src-supplier=Digi-Key; ComponentLink2URL: https://datasheet.ciiva.com/3944/28290436500227-pcb-headers-3944690.pdf?src-supplier=Arrow; ComponentLink2Description: https://datasheet.ciiva.com/3944/28290436500227-pcb-headers-3944690.pdf?src-supplier=Arrow; ComponentLink3URL: https://datasheet.ciiva.com/30077/0436500227-pcb-headers-30077244.pdf?src-supplier=Onlinecomponents.com; ComponentLink3Description: https://datasheet.ciiva.com/30077/0436500227-pcb-headers-30077244.pdf?src-supplier=Onlinecomponents.com; ComponentLink4URL: https://datasheet.ciiva.com/7920/1629867-7920765.pdf?src-supplier=Element14; ComponentLink4Description: https://datasheet.ciiva.com/7920/1629867-7920765.pdf?src-supplier=Element14
Q4 = MOSFET-N: Trans MOSFET N-CH 60V 2A Automotive 3-Pin SOT-23 T/R; Manufacturer: Vishay; Supplier 1: Digi-Key; Supplier Part Number 1: SQ2364EES-T1_GE3CT-ND; Pricing 1: 1=0.58000, 10=0.49500, 25=0.46200, 100=0.34320, 250=0.32604, 500=0.26796, 1000=0.21780 (USD); ComponentLink1URL: http://www.farnell.com/datasheets/2611857.pdf?src-supplier=Farnell; ComponentLink1Description: http://www.farnell.com/datasheets/2611857.pdf?src-supplier=Farnell; ComponentLink2URL: http://www.farnell.com/datasheets/2611857.pdf?src-supplier=Newark; ComponentLink2Description: http://www.farnell.com/datasheets/2611857.pdf?src-supplier=Newark
R11 = RES 0603: as R4 on sheet io; Supplier 1: Digi-Key; Supplier Part Number 1: A130085CT-ND; Category: Chip SMD Resistors; Pricing 1: 1=0.10000, 10=0.02100, 100=0.00860, 1000=0.00387, 2500=0.00336 (USD); Case/Package: 0603; Case Code (Imperial): 0603; Case Code (Metric): 1608; Min Operating Temperature: -55°C; Max Operating Temperature: 155°C; Composition: Thick Film; Features: Moisture Resistant,Automotive AEC-Q200; Packaging: Cut Tape; Tolerance: 5%; Number of Terminations: 2; ComponentLink1URL: https://www.te.com/commerce/DocumentDelivery/DDEController?Action=srchrtrv&amp;DocNm=1773204-3&amp;DocType=DS&amp;DocLang=English&src-supplier=Digi-Key; ComponentLink1Description: https://www.te.com/commerce/DocumentDelivery/DDEController?Action=srchrtrv&amp;DocNm=1773204-3&amp;DocType=DS&amp;DocLang=English&src-supplier=Digi-Key
R14 = RES 0603: as R5 on sheet io; Supplier 1: Digi-Key; Supplier Part Number 1: A130097CT-ND; Manufacturer: TE Connectivity; Manufacturer Part Number: CRGCQ0603J10K; Category: Chip SMD Resistors; Pricing 1: 1=0.10000, 10=0.02100, 100=0.00860, 1000=0.00387, 2500=0.00336 (USD); Case/Package: 0603; Case Code (Imperial): 0603; Case Code (Metric): 1608; Min Operating Temperature: -55°C; Max Operating Temperature: 155°C; Composition: Thick Film; Features: Moisture Resistant,Automotive AEC-Q200; Packaging: Tape and Reel; Tolerance: 5%; Number of Terminations: 2; ComponentLink1URL: https://4donline.ihs.com/images/VipMasterIC/IC/TYEL/TYEL-S-A0004929575/TYEL-S-A0004929575-1.pdf?hkey=52A5661711E402568146F3353EA87419&src-supplier=Farnell; ComponentLink1Description: https://4donline.ihs.com/images/VipMasterIC/IC/TYEL/TYEL-S-A0004929575/TYEL-S-A0004929575-1.pdf?hkey=52A5661711E402568146F3353EA87419&src-supplier=Farnell; ComponentLink2URL: https://4donline.ihs.com/images/VipMasterIC/IC/TYEL/TYEL-S-A0004929575/TYEL-S-A0004929575-1.pdf?hkey=52A5661711E402568146F3353EA87419&src-supplier=Newark; ComponentLink2Description: https://4donline.ihs.com/images/VipMasterIC/IC/TYEL/TYEL-S-A0004929575/TYEL-S-A0004929575-1.pdf?hkey=52A5661711E402568146F3353EA87419&src-supplier=Newark; ComponentLink3URL: https://www.te.com/commerce/DocumentDelivery/DDEController?Action=srchrtrv&amp;DocNm=1773204-3&amp;DocType=DS&amp;DocLang=English&src-supplier=Digi-Key; ComponentLink3Description: https://www.te.com/commerce/DocumentDelivery/DDEController?Action=srchrtrv&amp;DocNm=1773204-3&amp;DocType=DS&amp;DocLang=English&src-supplier=Digi-Key; ComponentLink4URL: http://www.te.com/commerce/DocumentDelivery/DDEController?Action=srchrtrv&DocNm=1773204-3&DocType=DS&DocLang=English&src-supplier=Digi-Key; ComponentLink4Description: http://www.te.com/commerce/DocumentDelivery/DDEController?Action=srchrtrv&DocNm=1773204-3&DocType=DS&DocLang=English&src-supplier=Digi-Key

## Sheet controller.SchDoc
size Letter
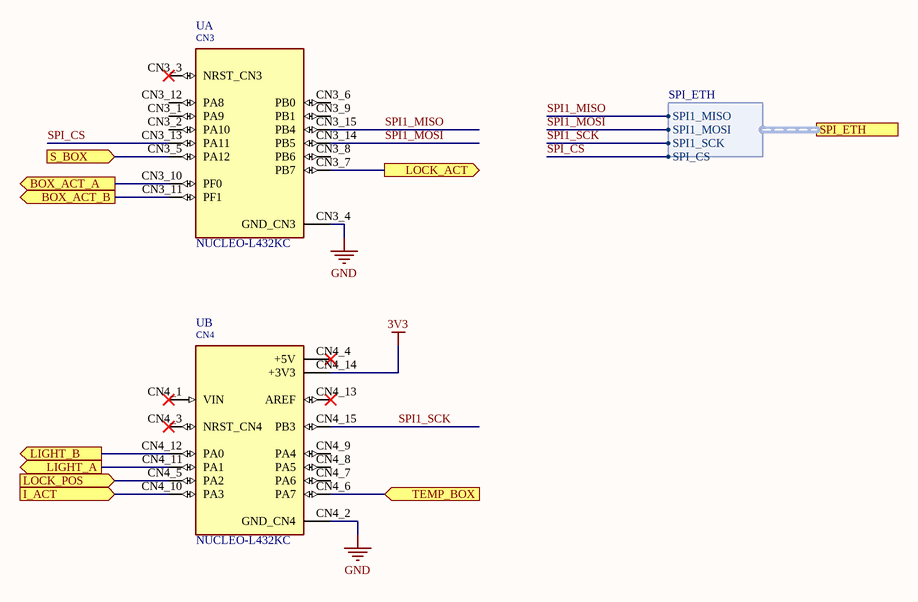
[diagram p4: controller.SchDoc]

### Parts
U  NUCLEO-L432KC  [MODULE_NUCLEO-L432KC]  (parts A,B of 2)

### Ports
BOX_ACT_A (out), BOX_ACT_B (out), I_ACT (in), LIGHT_A (out), LIGHT_B (out), LOCK_ACT (out), LOCK_POS (in), S_BOX (in), SPI_ETH (harness SPI_ETH), TEMP_BOX (in)

### Harnesses
SPI_ETH: SPI1_MISO, SPI1_MOSI, SPI1_SCK, SPI_CS

### Nets
3V3: U.CN4_14(+3V3)
GND: U.CN3_4(GND_CN3) U.CN4_2(GND_CN4)
SPI1_MISO: U.CN3_15(PB4) ; port SPI_ETH.SPI1_MISO  [project net MISO]
SPI1_MOSI: U.CN3_14(PB5) ; port SPI_ETH.SPI1_MOSI  [project net MOSI]
SPI1_SCK: U.CN4_15(PB3) ; port SPI_ETH.SPI1_SCK  [project net SCLK]
SPI_CS: U.CN3_13(PA11) ; port SPI_ETH.SPI_CS  [project net CS]
NetH2_2: U.CN4_5(PA2) ; port LOCK_POS
NetH5_1: U.CN3_5(PA12) ; port S_BOX
NetR4_2: U.CN3_7(PB7) ; port LOCK_ACT
NetR11_Box_Actuator_A_2: U.CN3_10(PF0) ; port BOX_ACT_A
NetR11_Box_Actuator_B_2: U.CN3_11(PF1) ; port BOX_ACT_B
NetR11_Light_A_2: U.CN4_11(PA1) ; port LIGHT_A
NetR11_Light_B_2: U.CN4_12(PA0) ; port LIGHT_B
NetU_CN4_6: U.CN4_6(PA7) ; port TEMP_BOX
NetU_CN4_10: U.CN4_10(PA3) ; port I_ACT

Not connected (* = marked no-connect by the designer): U CN3_1(PA9) CN3_2(PA10) CN3_3(NRST_CN3)* CN3_6(PB0) CN3_8(PB6) CN3_9(PB1) CN3_12(PA8) CN4_1(VIN)* CN4_3(NRST_CN4)* CN4_4(+5V)* CN4_7(PA6) CN4_8(PA5) CN4_9(PA4) CN4_13(AREF)*

### Notes on the sheet
- Title
- Size:
- Date:
- Letter
- Number:
- Time:
- Revision:
- Sheet
- of
- File:
- (in symbol NUCLEO-L432KC, part A) CN3
- (in symbol NUCLEO-L432KC, part B) CN4

### Library data of the parts
U = NUCLEO-L432KC: STM32L432KC, mbed-Enabled Development Nucleo-32 STM32L4 ARMÂ® CortexÂ®-M4 MCU 32-Bit Embedded Evaluation Board; MF: STMicroelectronics; Price: None; Value: *; Package: None; Availability: Unavailable; SnapEDA_Link: https://www.snapeda.com/parts/NUCLEO-L432KC/STMicroelectronics/view-part/628463/?ref=snap; MP: NUCLEO-L432KC